# EasyEDA Pro project 数控UPS.epro, schematic stm32最小
Board Name: Board1; Create Date: 2025-03-19; Page Name: P1; Project Name: 硬币大小的STM32F103C8T6最小系统板; Schematic Name: Schematic1; Update Date: 2025-03-19; Company: 嘉立创EDA
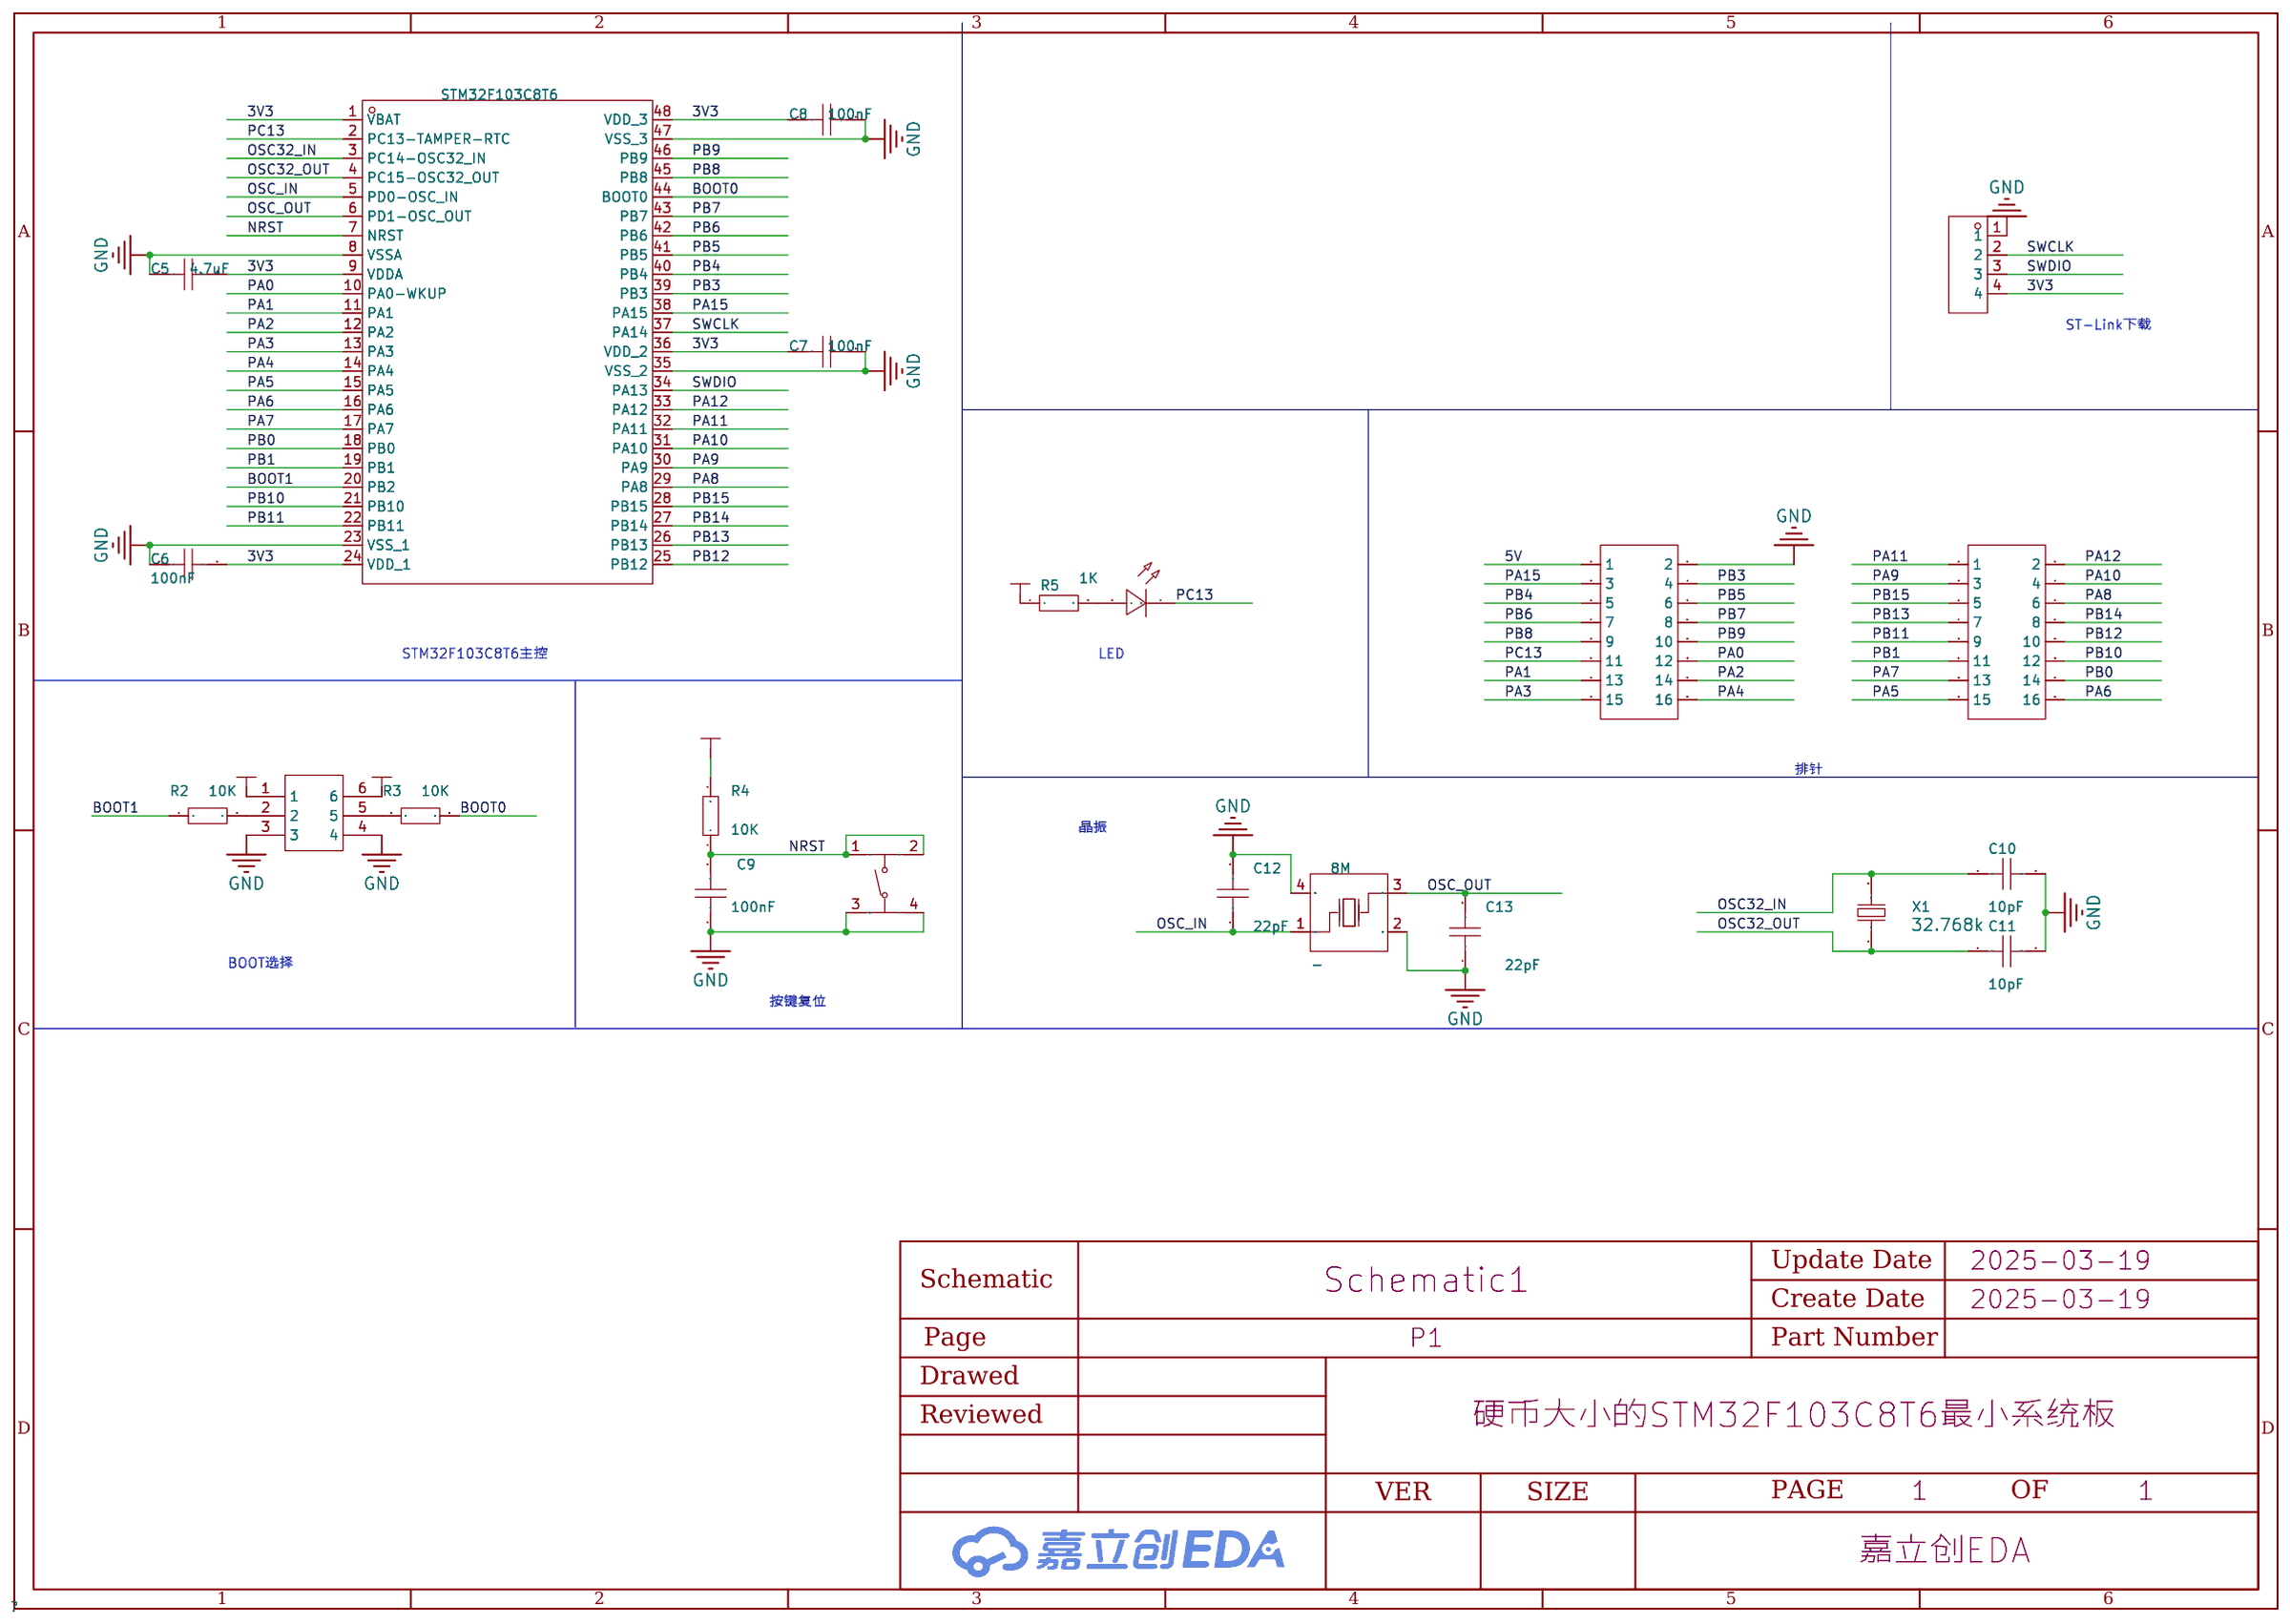
[diagram p2: schematic sheet]

## Parts
8M  -  [CRYSTAL-SMD_4P-L3.2-W2.5-BL]
C5  4.7uF  [C0603]
C6  100nF  [C0603]
C7  100nF  [C0603]
C8  100nF  [C0603]
C9  100nF  [C0603]
C10  10pF  [C0603]
C11  10pF  [C0603]
C12  22pF  [C0603]
C13  22pF  [C0603]
H1  -  [HDR-TH_4P-P2.54-V-M]
H3  -  [HDR-TH_16P-P2.54-V-M-R2-C8-S2.54]
H4  -  [HDR-TH_16P-P2.54-V-M-R2-C8-S2.54]
LED2  -  [LED0603-RD]
R2  10K  [R0603]
R3  10K  [R0603]
R4  10K  [R0603]
R5  1K  [R0603]
STM32F103C8T6  STM32F103C8T6  [LQFP-48_L7.0-W7.0-P0.50-LS9.0-BL]
SW1  3*4*2.5mm 贴片4脚  [SW-SMD_4P-L4.2-W3.3-P2.15-LS5.1]
U1  -  [焊点3*2]
X1  32.768k  [CRYSTAL-SMD_L2.0-W1.2]

## Library data of the parts
8M = 3225-20MHZ-15PF-10PPM: 晶振类型:-;频率:-;频率公差:-;频率稳定度:-;负载电容:-;工作温度:-;; Supplier Part: C337680; Manufacturer: TKD(泰晶); Supplier Footprint: SMD3225-4P; Datasheet: https://atta.szlcsc.com/upload/public/pdf/source/20190802/C337680_9848D2534D79F605CBAF32E63A57FC37.pdf; Supplier: LCSC
C5-C13 = CAP_0603: 容值:100nF;精度:±10%;额定电压:50V;温度系数:X7R;; Supplier Footprint: 0603
H1 = HDR-M_2.54_1x4P: Supplier Part: C492403; Supplier Footprint: 插件
H3 H4 = HDR-M_2.54_2x8: Supplier Part: C68234; Supplier Footprint: 插件,P=2.54mm
LED2 = LED_0603-G: 照明颜色:翠绿;色温 - CCT（K）:-;主波长/色坐标:520~535nm;; Supplier Footprint: 0603; Supplier Part: C72043
R2-R5 = Res_0603: Supplier Footprint: 0603
STM32F103C8T6 = STM32F103C8T6: CPU内核:ARM Cortex-M3;CPU最大主频:72MHz;工作电压范围:2V~3.6V;内部振荡器:有;程序 FLASH容量:64K@x8bit;RAM总容量:20KB;EEPROM/数据 FLASH容量:-;GPIO端口数量:37;ADC(单元数/通道数/位数):1@x10ch/12bit;外设/功能/协议栈:温度传感器；DMA；看门狗；POR；PWM;工作温度范围:-40~+85;; LCSC Part Name: STM32F103C8T6 MSL=3; Supplier Part: C8734; Manufacturer: ST(意法半导体); Supplier Footprint: LQFP-48_7x7x05P; Datasheet: https://atta.szlcsc.com/upload/public/pdf/source/20140724/1457707174202.pdf; Supplier: LCSC; CPU Core: ARM Cortex-M3; Maximum Frequency: 72MHz; Supply Voltage Range: 2V~3.6V; Internal Oscillator: 有; Program FLASH Size: 64K@x8bit; RAM Size: 20KB; GPIO Ports Number: 37; ADC (Units/Channels/bits): 1@x10ch/12bit; Peripherals / Functions / Protocol Stacks: 温度传感器；DMA；看门狗；POR；PWM; Operating Temperature Range: -40~+85
SW1 = 3*4*2.5mm 贴片4脚: Supplier Part: C9900020788; Supplier Footprint: SMD-4; JLCPCB Part Class: Extended Part; Datasheet: https://atta.szlcsc.comnull; Supplier: LCSC
U1 = 焊盘3*2
X1 = NX2012SA-32.768KHZ-EXS00A-MU00185: LCSC Part Name: 晶振; Supplier Part: C5136772; Manufacturer: NDK; Supplier Footprint: SMD2012-2P; Datasheet: https://atta.szlcsc.com/upload/public/pdf/source/20220817/FD1986C2337CA9746430CB47DBD29D81.pdf; Supplier: LCSC

## Nets
3V3: C5.1 C6.2 C7.1 C8.1 H1.4 R4.2 R5.1 STM32F103C8T6.1(VBAT) STM32F103C8T6.9(VDDA) STM32F103C8T6.24(VDD_1) STM32F103C8T6.36(VDD_2) STM32F103C8T6.48(VDD_3) U1.1 U1.6
5V: H3.1
GND: 8M.2(GND) 8M.4(GND) C5.2 C6.1 C7.2 C8.2 C9.1 C10.2 C11.2 C12.2 C13.1 H1.1 H3.2 STM32F103C8T6.8(VSSA) STM32F103C8T6.23(VSS_1) STM32F103C8T6.35(VSS_2) STM32F103C8T6.47(VSS_3) SW1.3 SW1.4 U1.3 U1.4
BOOT0: R3.2 STM32F103C8T6.44(BOOT0)
BOOT1: R2.1 STM32F103C8T6.20(PB2)
NRST: C9.2 R4.1 STM32F103C8T6.7(NRST) SW1.1 SW1.2
OSC32_IN: C10.1 STM32F103C8T6.3(PC14-OSC32_IN) X1.2
OSC32_OUT: C11.1 STM32F103C8T6.4(PC15-OSC32_OUT) X1.1
OSC_IN: 8M.1(OSC1) C12.1 STM32F103C8T6.5(PD0-OSC_IN)
OSC_OUT: 8M.3(OSC2) C13.2 STM32F103C8T6.6(PD1-OSC_OUT)
PA0: H3.12 STM32F103C8T6.10(PA0-WKUP)
PA1: H3.13 STM32F103C8T6.11(PA1)
PA2: H3.14 STM32F103C8T6.12(PA2)
PA3: H3.15 STM32F103C8T6.13(PA3)
PA4: H3.16 STM32F103C8T6.14(PA4)
PA5: H4.15 STM32F103C8T6.15(PA5)
PA6: H4.16 STM32F103C8T6.16(PA6)
PA7: H4.13 STM32F103C8T6.17(PA7)
PA8: H4.6 STM32F103C8T6.29(PA8)
PA9: H4.3 STM32F103C8T6.30(PA9)
PA10: H4.4 STM32F103C8T6.31(PA10)
PA11: H4.1 STM32F103C8T6.32(PA11)
PA12: H4.2 STM32F103C8T6.33(PA12)
PA15: H3.3 STM32F103C8T6.38(PA15)
PB0: H4.14 STM32F103C8T6.18(PB0)
PB1: H4.11 STM32F103C8T6.19(PB1)
PB3: H3.4 STM32F103C8T6.39(PB3)
PB4: H3.5 STM32F103C8T6.40(PB4)
PB5: H3.6 STM32F103C8T6.41(PB5)
PB6: H3.7 STM32F103C8T6.42(PB6)
PB7: H3.8 STM32F103C8T6.43(PB7)
PB8: H3.9 STM32F103C8T6.45(PB8)
PB9: H3.10 STM32F103C8T6.46(PB9)
PB10: H4.12 STM32F103C8T6.21(PB10)
PB11: H4.9 STM32F103C8T6.22(PB11)
PB12: H4.10 STM32F103C8T6.25(PB12)
PB13: H4.7 STM32F103C8T6.26(PB13)
PB14: H4.8 STM32F103C8T6.27(PB14)
PB15: H4.5 STM32F103C8T6.28(PB15)
PC13: H3.11 LED2.1(C) STM32F103C8T6.2(PC13-TAMPER-RTC)
SWCLK: H1.2 STM32F103C8T6.37(PA14)
SWDIO: H1.3 STM32F103C8T6.34(PA13)
$1N4997: LED2.2(A) R5.2
$1N8787: R2.2 U1.2
$1N8790: R3.1 U1.5

## Notes on the sheet
- ST-Link下载
- STM32F103C8T6主控
- LED
- 排针
- 晶振
- BOOT选择
- 按键复位
